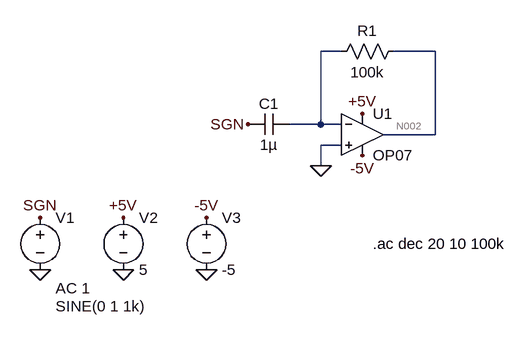
[diagram p0: schematic Draft1.asc]
Draft1.asc, the LTspice schematic file:
Version 4.1
SHEET 1 880 680
WIRE 192 32 160 32
WIRE 336 32 272 32
WIRE 160 144 160 32
WIRE 160 144 112 144
WIRE 192 144 160 144
WIRE 336 160 336 32
WIRE 336 160 256 160
WIRE 192 176 160 176
WIRE 160 208 160 176
FLAG 160 208 0
FLAG -272 368 0
FLAG -144 368 0
FLAG -16 368 0
FLAG -272 288 SGN
FLAG 224 128 +5V
FLAG 48 144 SGN
FLAG -144 288 +5V
FLAG -16 288 -5V
FLAG 224 192 -5V
SYMBOL OpAmps\\OP07 224 96 R0
SYMATTR InstName U1
SYMBOL cap 112 128 R90
WINDOW 0 0 32 VBottom 2
WINDOW 3 32 32 VTop 2
SYMATTR InstName C1
SYMATTR Value 1µ
SYMBOL res 288 16 R90
WINDOW 0 0 56 VBottom 2
WINDOW 3 32 56 VTop 2
SYMATTR InstName R1
SYMATTR Value 100k
SYMBOL voltage -272 272 R0
WINDOW 3 24 152 Left 2
WINDOW 123 24 124 Left 2
WINDOW 39 0 0 Left 0
SYMATTR Value SINE(0 1 1k)
SYMATTR Value2 AC 1
SYMATTR InstName V1
SYMBOL voltage -144 272 R0
WINDOW 123 0 0 Left 0
WINDOW 39 0 0 Left 0
SYMATTR InstName V2
SYMATTR Value 5
SYMBOL voltage -16 272 R0
WINDOW 123 0 0 Left 0
WINDOW 39 0 0 Left 0
SYMATTR InstName V3
SYMATTR Value -5
TEXT 240 328 Left 2 !.ac dec 20 10 100k

The netlist it stands for:
* Draft1.asc
X§U1 0 N001 +5V -5V N002 LT1001  ; OP07, pins In+ In- V+ V- OUT
C1 N001 SGN 1µ
R1 N002 N001 100k
V1 SGN 0 SINE(0 1 1k) AC 1
V2 +5V 0 5
V3 -5V 0 -5
.ac dec 20 10 100k
.lib LTC.lib
.backanno
.end

* Results of the author's LTspice run, read from the files saved beside the schematic
* Operating Point, zero values left out:
*   V(+5v) = 5 V
*   V(-5v) = -5 V
*   I(V2) = -2.25 mA
*   I(V3) = 2.25 mA
*   Ix(u1:3) = 2.25 mA
*   Ix(u1:4) = -2.25 mA
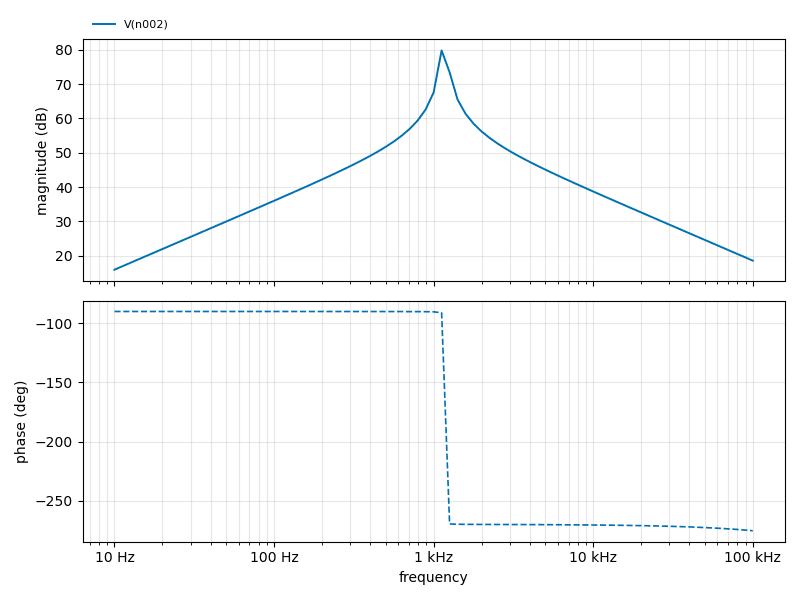
[diagram p1: AC Analysis of Draft1.asc, plotted from the saved traces]
* AC Analysis, 1 run:
*   V(n002): 15.96 dB at 10 Hz, 18.59 dB at 100 kHz, peak 79.81 dB at 1.122 kHz, 3 dB below the peak at 1.091 kHz and 1.185 kHz